# Altium schematic sheet MDL_RECEPTOR_IRF_1.SchDoc
size A4
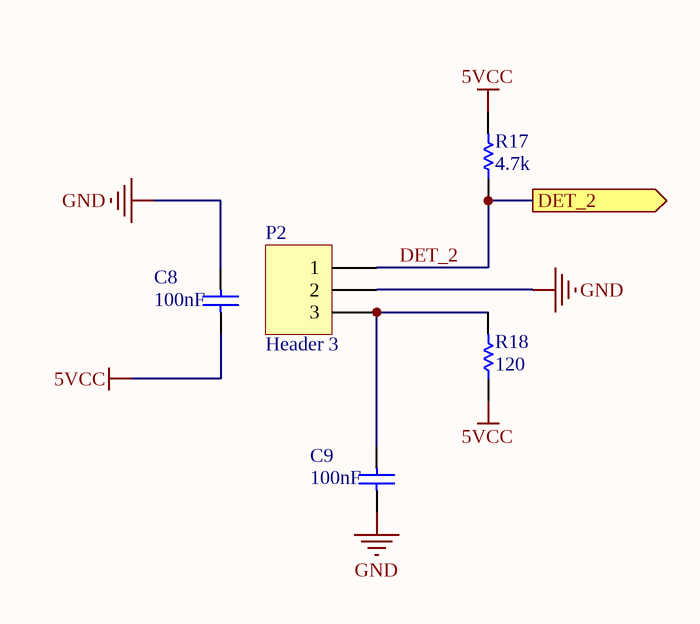
[diagram p0: MDL_RECEPTOR_IRF_1.SchDoc]

## Parts
C8  value 100nF  [VP44-2.5]  (hidden comment: VP44BY224JB)
C9  value 100nF  [VP44-2.5]  (hidden comment: VP44BY224JB)
P2  Header 3  [HDR1X3]
R17  value 4.7k  [AXIAL-0.3]  (hidden comment: Res)
R18  value 120  [AXIAL-0.3]  (hidden comment: Res)

## Ports
DET_2 (out)

## Nets
5VCC: C8.2 R17.2 R18.1
GND: C8.1 C9.2 P2.2
DET_2: P2.1 R17.1 ; port DET_2
NetC9_1: C9.1 P2.3 R18.2

## Library data of the parts
C8 C9 = VP44BY224JB: Dipped Radial Multilayer Ceramic Capacitor X7R: 220nF, 100V; Published: 17-Dec-2003; DatasheetDocument: 4-Feb-2002; PackageDocument: 4-Feb-2002; PackageReference: VP44-2.5; Publisher: Altium Limited; ComponentLink1Description: Manufacturer Link; ComponentLink1URL: http://www.vishay.com/
P2 = Header 3: Header, 3-Pin; LatestRevisionDate: 17-Jul-2002; LatestRevisionNote: Re-released for DXP Platform.; Publisher: Altium Limited
R17 R18 = Res1: Resistor; Published: 8-Jun-2000; LatestRevisionDate: 17-Jul-2002; LatestRevisionNote: Re-released for DXP Platform.; PackageReference: AXIAL-0.3; Publisher: Altium Limited